# Altium project AIR Purifier.PrjPcb
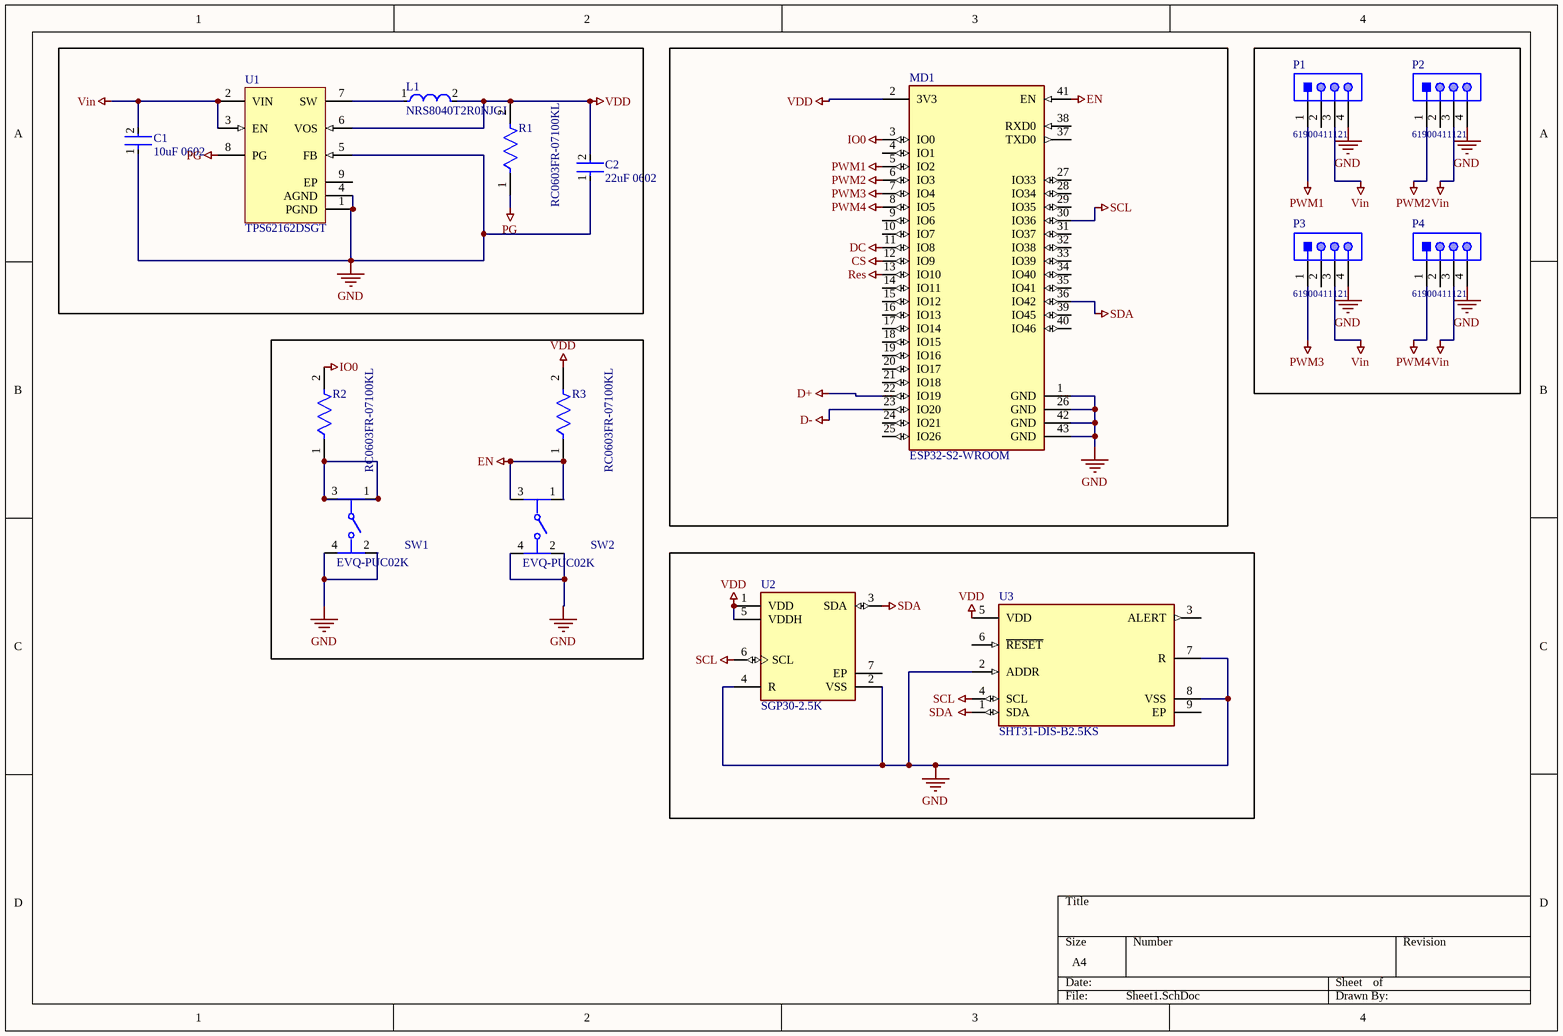
[diagram p0: Sheet1.SchDoc]
1 sheet, 16 parts. Net scope: global (net labels, ports and power ports of the same name join across sheets).
Board file: PCB1.PcbDoc

## Sheet Sheet1.SchDoc
size A4; SheetNumber: 1; SheetTotal: 1

### Parts
C1  10uF 0602  [FP-GRM188-0_1-e0_2_0_55-IPC_A]
C2  22uF 0602  [FP-GRM188-0_1-e0_2_0_55-IPC_A]
L1  NRS8040T2R0NJGJ  [FP-NR8040-H_4_2-MFG]
MD1  ESP32-S2-WROOM  [FP-ESP32-S2-WROOM-MFG]
P1  61900411121  [61900411121]
P2  61900411121  [61900411121]
P3  61900411121  [61900411121]
P4  61900411121  [61900411121]
R1  RC0603FR-07100KL  [FP-RC0603-0_55-MFG]
R2  RC0603FR-07100KL  [FP-RC0603-0_55-MFG]
R3  RC0603FR-07100KL  [FP-RC0603-0_55-MFG]
SW1  EVQ-PUC02K  [FP-EVQ-PUC02K-MFG]
SW2  EVQ-PUC02K  [FP-EVQ-PUC02K-MFG]
U1  TPS62162DSGT  [DSG0008A_V]
U2  SGP30-2.5K  [FP-SGP30-2_5K-MFG]
U3  SHT31-DIS-B2.5KS  [FP-SHT31-DIS-B2_5KS-MFG]

### Nets
CS: MD1.12(IO9)
D+: MD1.22(IO19)
D-: MD1.23(IO20)
DC: MD1.11(IO8)
EN: MD1.41(EN) R3.1 SW2.1 SW2.3
GND: C1.1 C2.1 MD1.1(GND) MD1.26(GND) MD1.42(GND) MD1.43(GND) P1.4 P2.4 P3.4 P4.4 SW1.2 SW1.4 SW2.2 SW2.4 U1.1(PGND) U1.4(AGND) U1.5(FB) U2.2(VSS) U2.4(R) U3.2(ADDR) U3.7(R) U3.8(VSS)
IO0: MD1.3(IO0) R2.2
PG: R1.1 U1.8(PG)
PWM1: MD1.5(IO2) P1.1
PWM2: MD1.6(IO3) P2.1
PWM3: MD1.7(IO4) P3.1
PWM4: MD1.8(IO5) P4.1
Res: MD1.13(IO10)
SCL: MD1.30(IO36) U2.6(SCL) U3.4(SCL)
SDA : MD1.36(IO42) U2.3(SDA) U3.1(SDA)
VDD: C2.2 L1.2 MD1.2(3V3) R1.2 R3.2 U1.6(VOS) U2.1(VDD) U2.5(VDDH) U3.5(VDD)
Vin: C1.2 P1.3 P2.3 P3.3 P4.3 U1.2(VIN) U1.3(EN)
NetL1_1: L1.1 U1.7(SW)
NetR2_1: R2.1 SW1.1 SW1.3

Not connected (* = marked no-connect by the designer): MD1 4(IO1) 9(IO6) 10(IO7) 14(IO11) 15(IO12) 16(IO13) 17(IO14) 18(IO15) 19(IO16) 20(IO17) 21(IO18) 24(IO21) 25(IO26) 27(IO33) 28(IO34) 29(IO35) 31(IO37) 32(IO38) 33(IO39) 34(IO40) 35(IO41) 37(TXD0) 38(RXD0) 39(IO45) 40(IO46); P1 2; P2 2; P3 2; P4 2; U1 9(EP); U2 7(EP); U3 3(ALERT) 6(~{RESET}) 9(EP)

### Library data of the parts
C1 C2 = CMP-2006-02792-2: Chip Multilayer Ceramic Capacitors for General Purpose, 0603, 10uF, X5R, 15%, 20%, 6.3V; Packaging: Tape and Reel; Voltage Rating (DC): 6.3V; Width: 0.031inch; Termination: SMD/SMT; Dielectric: X5R; Package Quantity: 4000; Voltage Rating: 6.3V; Capacitance: 10uF; Case/Package: 0603; Min Operating Temperature: -55°C; Voltage: 6.3V; Length: 1.6mm; Thickness: 0.035inch; Lead Free: Lead Free; Depth: 0.8mm; Case Code (Imperial): 0603; Max Operating Temperature: 85°C; Material: Ceramic; Height: 0.8mm; Tolerance: 20%; Mount: Surface Mount; REACH SVHC: No SVHC; Radiation Hardening: No; Case Code (Metric): 1608
L1 = CMP-14484-001195-1: Shielded Wirewound Inductor 2uH 30% 7.6A 11.7mΩ SMD; RMS Current (Irms): 6.3A; Test Frequency: 100kHz; Self Resonant Frequency: 50MHz; Max DC Current: 8.1A; DC Resistance (DCR): 11.7mR; Core Material: Ferrite; Length: 8mm; Number of Pins: 2; RoHS Compliant: Yes; Inductance Tolerance: 30%; Max Operating Temperature: 125°C; Min Operating Temperature: -25°C; Shielding: Shielded; Halogen Free: Halogen Free; Tolerance: 30%; Lead Pitch: 5.6mm; Current Rating: 6.3A; Inductance: 2uH; Termination: SMD/SMT; Resistor Type: Wirewound; Packaging: Tape and Reel; Lead Free: Lead Free; Series: NRS; Case/Package: 8040; Package Quantity: 1000; Saturation Current: 8.1A; Height - Seated (Max): 0.157inch; Height: 4mm; Depth: 8.2mm; Width: 0.315inch; Radiation Hardening: No; Mount: Surface Mount
MD1 = CMP-194065-000020-1: RX TXRX MOD WIFI SURFACE MOUNT
P1-P4 = CMP-1502-00586-1: Male Locking Header WR-WTB, THT, Vertical, pitch 2.54 mm, 1 x 4 position; Manufacturer: Wurth Elektronik; Working Voltage: 250VAC; Pitch: 2.54mm; Contact Resistance: 20mOhm; Position: 1x4; Publisher: WurthElektronik; Manufacturer URL: http://www.we-online.de; Datasheet URL: https://katalog.we-online.de/em/datasheet/6190xx11121.pdf; Operating Temperature: -40to105degC; Packaging: Bag; Gender: Male; Package Reference: 61900411121; Orientation: Vertical; Mounting Technology: THT; Part Number: 61900411121
R1-R3 = CMP-2100-03662-2: RES SMD 100K OHM 1% 1/10W 0603; Voltage Rating (DC): 50V; Resistance: 100kR; Max Power Dissipation: 100mW; Temperature Coefficient: 100ppm/°C; Working Voltage: 75V; Length: 1.6mm; Lead Free: Lead Free; Number of Terminations: 2; Packaging: Tape and Reel; Voltage Rating: 50V; Termination: SMD/SMT; Width: 0.8mm; Resistor Type: Thick Film; Resistance Tolerance: 1%; Features: Moisture Resistant; Height: 0.45mm; Construction: Rectangular; Case/Package: 0603; Military Standard: Not; Case Code (Imperial): 0603; Series: RC; Technology: THICK FILM; Depth: 0.8mm; RoHS Compliant: Yes; REACH SVHC: No SVHC; Min Operating Temperature: -55°C; Case Code (Metric): 1608; Max Operating Temperature: 155°C; Power Rating: 100mW; Number of Pins: 2; Tolerance: 1%
SW1 SW2 = CMP-05618-000046-1: SWITCH TACTILE SPST-NO 0.05A 12V; Current Rating: 50mA; Operating Force: 2.2N; Actuator Color: Black; Mechanical Life: 100000Cycles; Switch Function: Off-Mom; Switch Travel: 0.3mm; Throw Configuration: SPST; Contact Resistance: 500mR; Illumination Type: Non-Illuminated; Actuator Length: 1mm; Mount: Surface Mount; Contact Plating: Silver; Series: EVQPU; Packaging: Tape and Reel; Height: 1.65mm; Radiation Hardening: No; Termination: Gull Wing; Depth: 4.5mm; Max Operating Temperature: 70°C; RoHS Compliant: Yes; Contact Current Rating: 50mA; Length: 6.4mm; Electrical Life: 100000Cycles; Max Voltage Rating (DC): 12V; Package Quantity: 1; Width: 3.5mm; Min Operating Temperature: -40°C; Max Current Rating: 50mA; Orientation: Straight; Voltage Rating (DC): 12V; Size: 3.5mm; Lead Free: Lead Free
U1 = CMP-0323-00319-3: Buck Step Down Regulator with 3 to 17 V Input and 3.3 V Output, -40 to 85 degC, 8-Pin WSON (DSG), Green (RoHS & no Sb/Br); Manufacturer: Texas Instruments; Synchronous Rectification: TRUE; Iq(Typ)(mA): 0.017; Switch Current Limit(Typ)(A): 1.8; Regulated Outputs(#): 1; Duty Cycle(Max)(%): 100; SubFamily: Step-Down Regulator; Preset Vout(V): 3.3; Rating: Catalog; Vin(Max)(V): 17; Vin(Min)(V): 3; ComponentLink2Description: Package Specification; PackageVersion: revB, Oct-2010; DatasheetVersion: SLVSAM2A; ComponentLink1Description: Datasheet; PackageDescription: 8-Pin Plastic Small Outline No-Lead, 2 x 2 x 0.8 mm Body, 0.5 mm Pitch, Exposed Pad; ComponentLink2URL: http://www.ti.com/litv/pdf/mpds308a; Code_JEDEC: MO-229; PartNumber: TPS62162DSGT; ComponentLink3URL: Samples URL:http://www.ti.com/product/tps54611#samples; Mounting Technology: Surface Mount; Eco-Plan: Green (RoHS & no Sb/Br); Vout(Min)(V): 3.3; PackageReference: DSG0008A; Topology: Buck; ComponentLink1URL: http://www.ti.com/general/docs/lit/getliterature.tsp?genericPartNumber=TPS62162&fileType=pdf; Vout(Max)(V): 3.3; Iout(Max)(A): 1; ComponentLink3Description: URL Link1
U2 = CMP-144026-000002-1: AIR QUALITY GAS SENSOR FOR VOC'S; Manufacturer: Sensirion; Min Supply Voltage: 1.62V; Sensor Output: I2C; Operating Supply Current: 48.8mA; Max Supply Voltage: 1.98V; Description: Air Quality Sensor I²C; Category: IC; Automotive: No; Device Class L3: unset; Device Class L1: Sensors; Device Class L2: unset; Temperature Range High: +85°C; Manufacturer Part Number: SGP30-2.5K; Octopart: https://octopart.com/sgp30-2.5k-sensirion-84561789; Height: 0.9mm; Temperature: -40°C to +85°C; Lead Free: Yes; Package: SGP30-2.5K; Temperature Range Low: -40°C; Digikey Description: AIR QUALITY GAS SENSOR FOR VOC'S; RoHS: TRUE; ComponentLink2Description: Datasheet; ComponentLink2URL: https://www.sensirion.com/fileadmin/user_upload/customers/sensirion/Dokumente/0_Datasheets/Gas/Sensirion_Gas_Sensors_SGP30_Datasheet.pdf
U3 = CMP-144040-000009-1: SENSOR HUMID/TEMP 5V I2C 2% SMD; RoHS Compliant: Yes